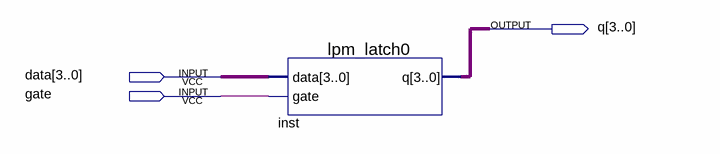
[diagram p0: schematic sheet]
// Quartus schematic lpm_lab_01.bdf as structural Verilog: 1 symbols, 3 pins
module lpm_lab_01 (
  input  [3:0] data,
  input  gate,
  output [3:0] q
);

  lpm_latch0 inst (.data(data), .gate(gate), .q(q));
endmodule
